# EAGLE design fbrf-rfm22 (EAGLE 4.16)
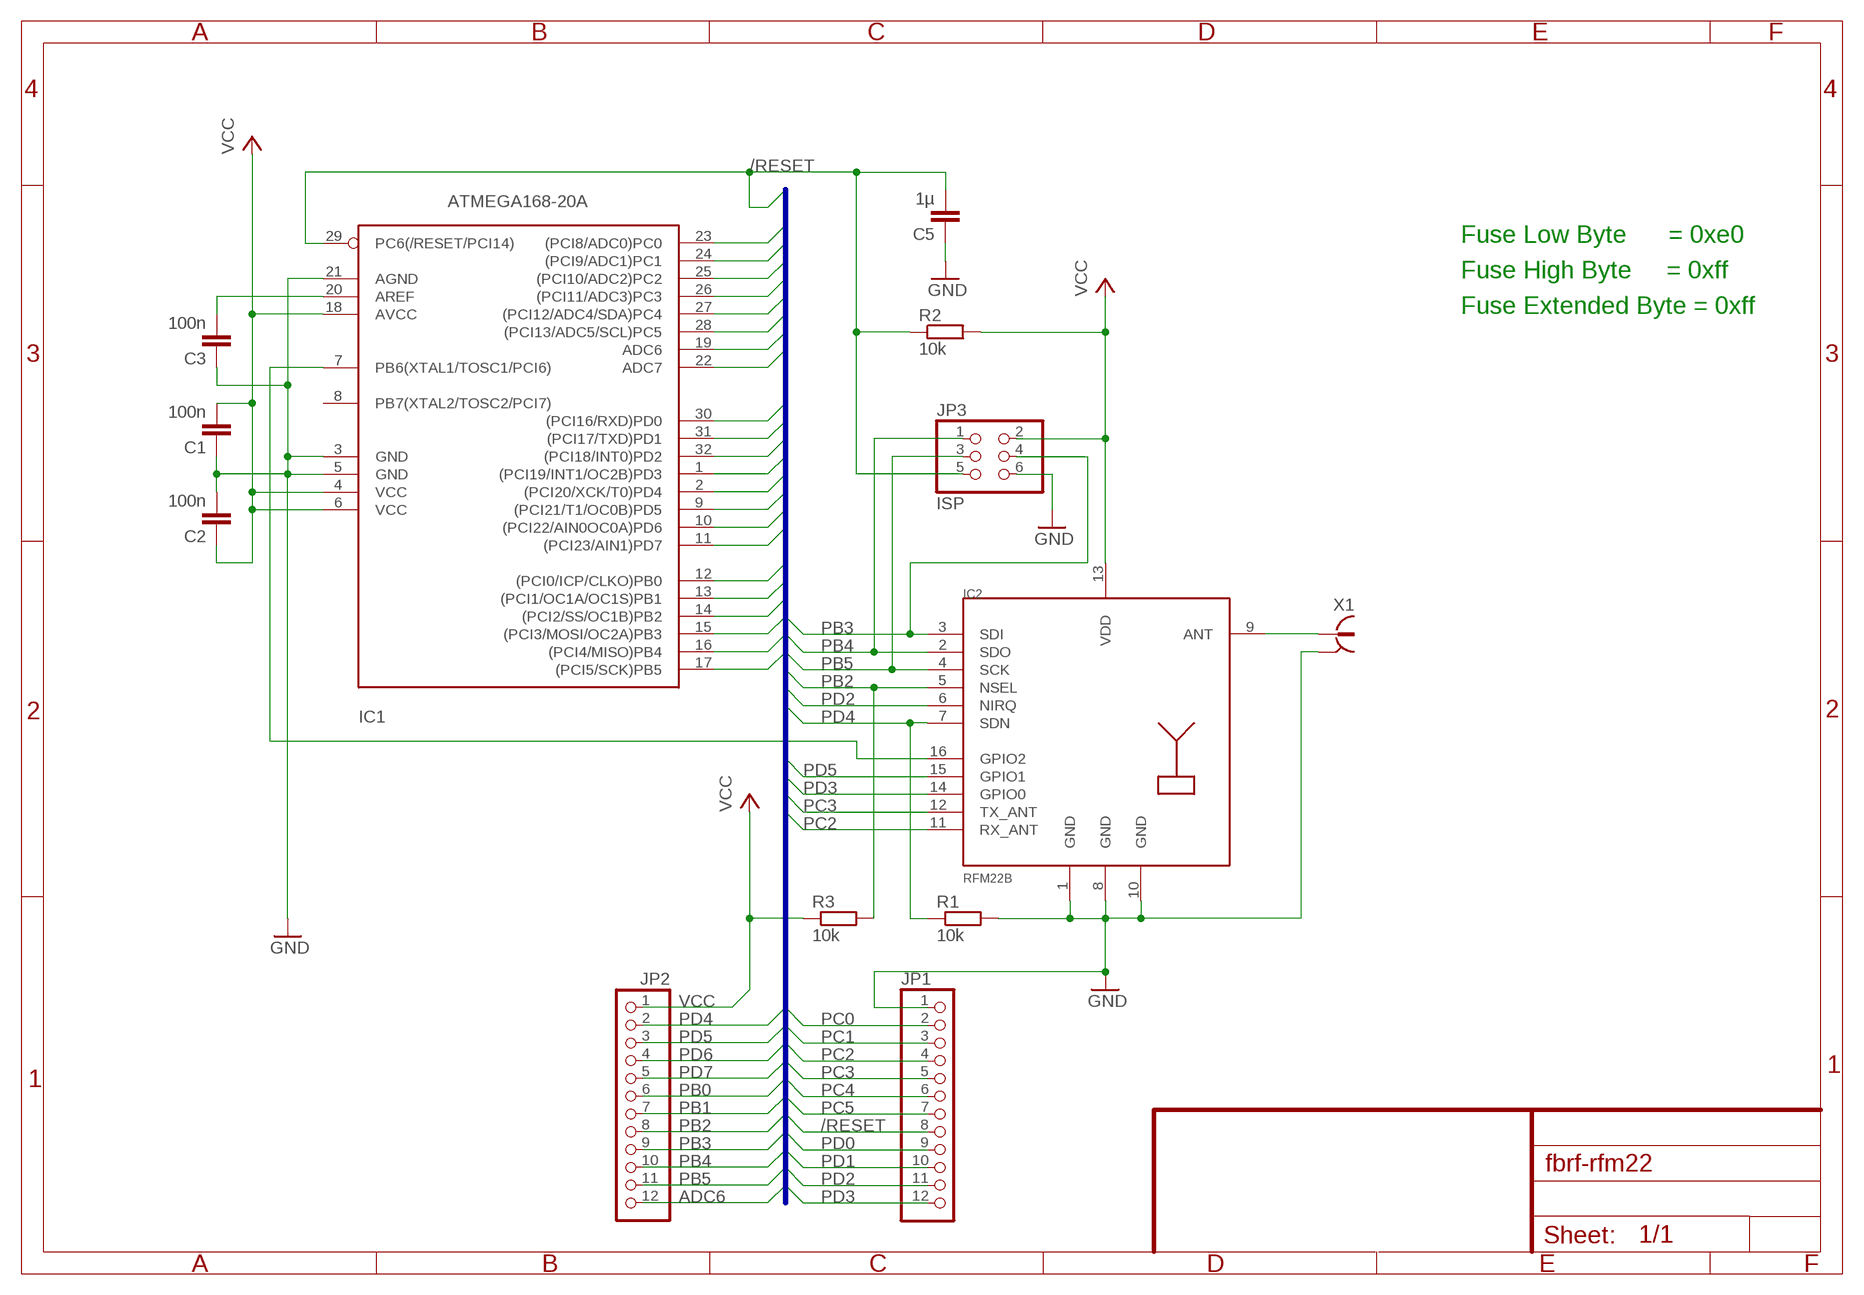
[diagram p0: schematic, sheet 1]

## Parts
C1  100n  C-EUC1206  [C1206]
C2  100n  C-EUC1206  [C1206]
C3  100n  C-EUC1206  [C1206]
C5  1µ  C-EUC0805  [C0805]
IC1  ATMEGA168-20A  ATMEGA88-20A  [TQFP32-08]
IC2  RFM22B  [RFM2]
JP1  PINHD-1X12  [1X12]
JP2  PINHD-1X12  [1X12]
JP3  ISP  PINHD-2X3  [2X03]
R1  10k  R-EU_R0805  [R0805]
R2  10k  R-EU_R0805  [R0805]
R3  10k  R-EU_R0805  [R0805]
X1  ST-SMB-V  [ST-SMB-V]

## Nets
/RESET: C5.2 IC1.29(PC6(/RESET/PCI14)) JP1.8 JP3.5 R2.1
ADC6: IC1.19(ADC6) JP2.12
ADC7: IC1.22(ADC7)
CLK: IC1.7(PB6(XTAL1/TOSC1/PCI6)) IC2.16(GPIO2)
GND: C1.1 C2.2 C3.1 C5.1 IC1.3(GND) IC1.5(GND) IC1.21(AGND) IC2.1(GND) IC2.8(GND) IC2.10(GND) JP1.1 JP3.6 R1.2 X1.2(GND)
N$2: IC2.9(ANT) X1.1
N$3: C3.2 IC1.20(AREF)
PB0: IC1.12((PCI0/ICP/CLKO)PB0) JP2.6
PB1: IC1.13((PCI1/OC1A/OC1S)PB1) JP2.7
PB2: IC1.14((PCI2/SS/OC1B)PB2) IC2.5(NSEL) JP2.8 R3.2
PB3: IC1.15((PCI3/MOSI/OC2A)PB3) IC2.3(SDI) JP2.9 JP3.4
PB4: IC1.16((PCI4/MISO)PB4) IC2.2(SDO) JP2.10 JP3.1
PB5: IC1.17((PCI5/SCK)PB5) IC2.4(SCK) JP2.11 JP3.3
PC0: IC1.23((PCI8/ADC0)PC0) JP1.2
PC1: IC1.24((PCI9/ADC1)PC1) JP1.3
PC2: IC1.25((PCI10/ADC2)PC2) IC2.11(RX_ANT) JP1.4
PC3: IC1.26((PCI11/ADC3)PC3) IC2.12(TX_ANT) JP1.5
PC4: IC1.27((PCI12/ADC4/SDA)PC4) JP1.6
PC5: IC1.28((PCI13/ADC5/SCL)PC5) JP1.7
PD0: IC1.30((PCI16/RXD)PD0) JP1.9
PD1: IC1.31((PCI17/TXD)PD1) JP1.10
PD2: IC1.32((PCI18/INT0)PD2) IC2.6(NIRQ) JP1.11
PD3: IC1.1((PCI19/INT1/OC2B)PD3) IC2.14(GPIO0) JP1.12
PD4: IC1.2((PCI20/XCK/T0)PD4) IC2.7(SDN) JP2.2 R1.1
PD5: IC1.9((PCI21/T1/OC0B)PD5) IC2.15(GPIO1) JP2.3
PD6: IC1.10((PCI22/AIN0OC0A)PD6) JP2.4
PD7: IC1.11((PCI23/AIN1)PD7) JP2.5
VCC: C1.2 C2.1 IC1.4(VCC) IC1.6(VCC) IC1.18(AVCC) IC2.13(VDD) JP2.1 JP3.2 R2.2 R3.1
Unconnected: IC1.8(PB7(XTAL2/TOSC2/PCI7))

## Buses
PC[0..5],ADC6,ADC7,PD[0..7],PB[0..5],/RESET

## Notes on the sheet
- Fuse Low Byte      = 0xe0
- Fuse High Byte     = 0xff
- Fuse Extended Byte = 0xff

## Power pins joined to a net without a drawn wire
GND: X1.3(GND) X1.4(GND) X1.5(GND)

## Library data of the parts
C1-C3 C5 = rcl:C-EU: CAPACITOR, European symbol
IC1 = avr:ATMEGA88: MICROCONTROLLER 8 kBytes FLASH 1 kBytes SRAM 512 Bytes EEPROM USART 8-channel 10 bit ADC
IC2 = RFMxx:RFM22B
JP1 JP2 = pinhead:PINHD-1X12: PIN HEADER
JP3 = pinhead:PINHD-2X3: PIN HEADER
R1-R3 = rcl:R-EU_: RESISTOR, European symbol
X1 = con-coax:ST-SMB-V: MALE SMB CONNECTOR Radiall distributor RS 193-8855G7

## Board
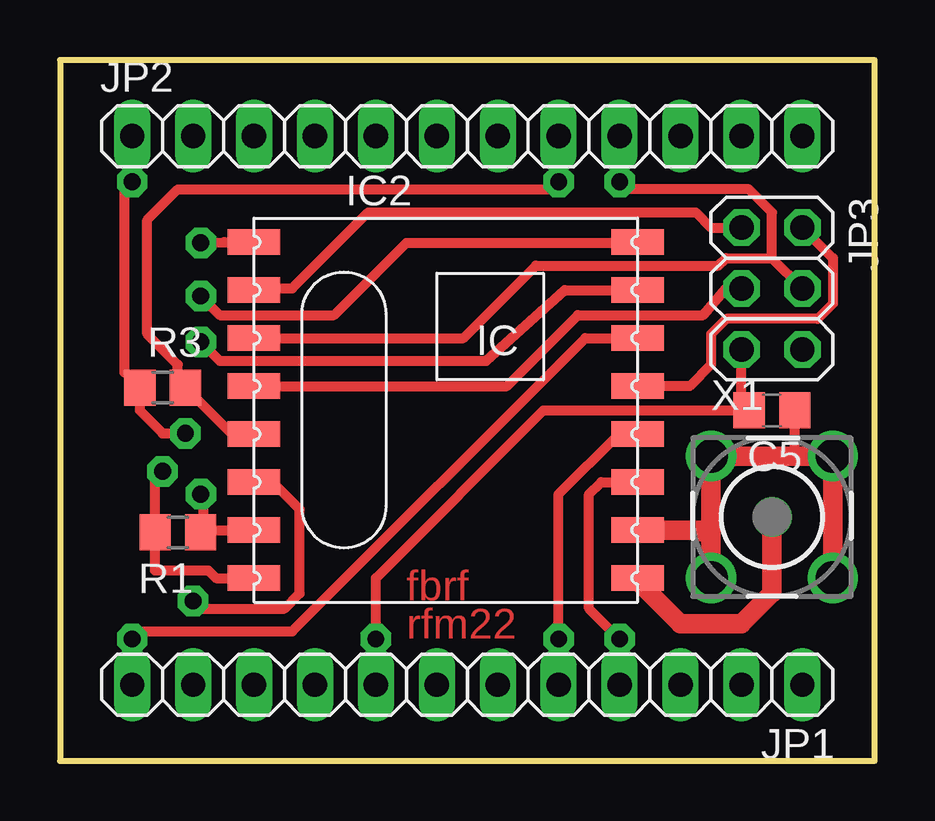
[diagram p1: board, top side]
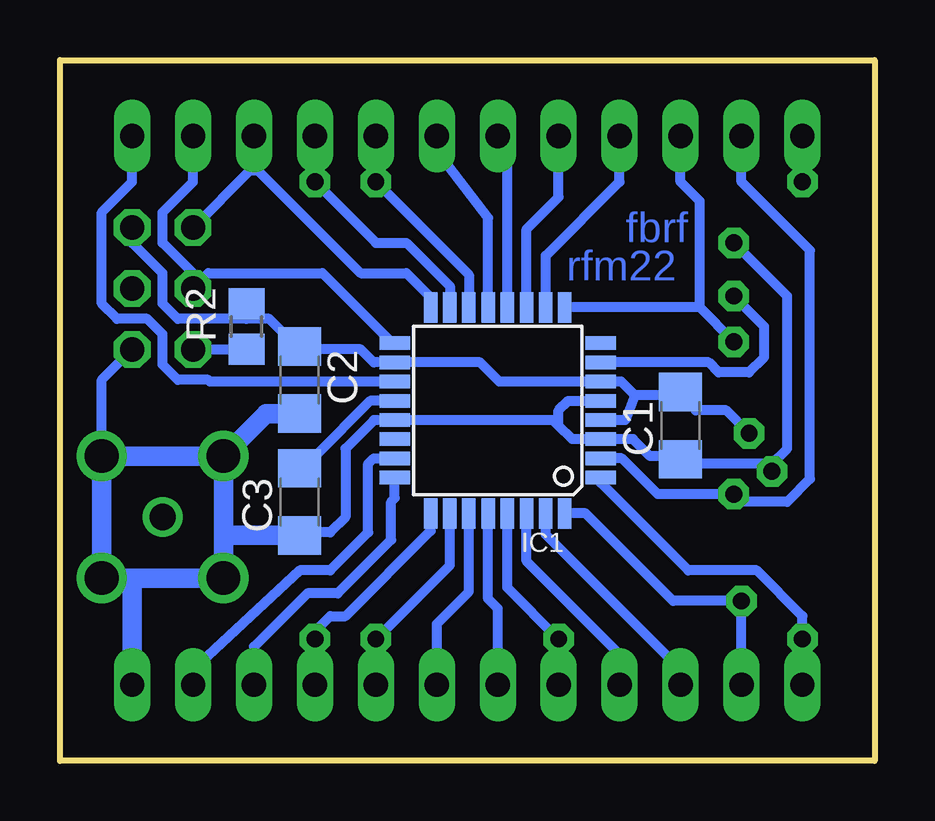
[diagram p2: board, bottom side, seen from below]

Size 33.96 x 29.2 mm. Coordinates in mm from the lower left corner, seen from the top.
Outline: 0,0 33.96,0 33.96,29.2 0,29.2 0,0
Copper layers (1*16): Top 0.035mm / dielectric 1.5mm / Bottom 0.035mm
Design rules "default": minimum track width 10mil, minimum drill 24mil, track to track 8mil, track to pad 8mil, pad to pad 8mil, via to via 8mil, smd to smd 4mil, copper to edge 40mil, drill to drill 8mil, minimum pad ring 10mil, minimum via ring 8mil, stop-mask expansion 4mil, vias tented up to drill 0mil, thermal gap 10mil

### Footprints (pad centres in the part's own frame; a part is rotated, then mirrored left to right if it is on the bottom)
C1206 = smd 1.6 x 1.8: 1 -1.4,0; 2 1.4,0
C0805 = smd 1.3 x 1.5: 1 -0.95,0; 2 0.95,0
TQFP32-08 = smd 1.27 x 0.559: 1 -4.293,2.8; 2 -4.293,2; 3 -4.293,1.2; 4 -4.293,0.4; 5 -4.293,-0.4; 6 -4.293,-1.2; 7 -4.293,-2; 8 -4.293,-2.8; 17 4.293,-2.8; 18 4.293,-2; 19 4.293,-1.2; 20 4.293,-0.4; 21 4.293,0.4; 22 4.293,1.2; 23 4.293,2; 24 4.293,2.8 | smd 0.559 x 1.27: 9 -2.8,-4.293; 10 -2,-4.293; 11 -1.2,-4.293; 12 -0.4,-4.293; 13 0.4,-4.293; 14 1.2,-4.293; 15 2,-4.293; 16 2.8,-4.293; 25 2.8,4.293; 26 2,4.293; 27 1.2,4.293; 28 0.4,4.293; 29 -0.4,4.293; 30 -1.2,4.293; 31 -2,4.293; 32 -2.8,4.293
RFM2 = smd 2.184 x 1.067: 1 -7.62,6.38; 2 -7.62,4.38; 3 -7.62,2.38; 4 -7.62,0.38; 5 -7.62,-1.62; 6 -7.62,-3.62; 7 -7.62,-5.62; 8 -7.62,-7.62; 9 8.38,-7.62; 10 8.38,-5.62; 11 8.38,-3.62; 12 8.38,-1.62; 13 8.38,0.38; 14 8.38,2.38; 15 8.38,4.38; 16 8.38,6.38
1X12 = drill 1.016 long: 1 -13.97,0; 2 -11.43,0; 3 -8.89,0; 4 -6.35,0; 5 -3.81,0; 6 -1.27,0; 7 1.27,0; 8 3.81,0; 9 6.35,0; 10 8.89,0; 11 11.43,0; 12 13.97,0
2X03 = drill 1.016 octagon: 1 -2.54,-1.27; 2 -2.54,1.27; 3 0,-1.27; 4 0,1.27; 5 2.54,-1.27; 6 2.54,1.27
R0805 = smd 1.3 x 1.5: 1 -0.95,0; 2 0.95,0
ST-SMB-V = drill 1.1 round: 1 0,0 | drill 1.4 round: 2 -2.54,2.54; 3 2.54,2.54; 4 2.54,-2.54; 5 -2.54,-2.54

### Placement (x,y rotation side)
C1  8.09,13.97 90 bottom
C2  23.96,15.87 270 bottom
C3  23.96,10.79 90 bottom
C5  29.68,14.6 180 top
IC1  15.71,14.6 180 bottom
IC2  15.71,15.24 0 top
JP1  16.98,3.17 180 top
JP2  16.98,26.03 0 top
JP3  29.68,19.68 270 top
R1  4.92,9.52 180 top
R2  26.19,18.09 90 bottom
R3  4.28,15.55 0 top
X1  29.68,10.16 0 top

### Tracks (layer width: path | path; a pad name or v marks a point on that pad's centre or on a via)
/RESET  (via drill 0.7 pad 1.27)
  Top 0.406: v13.17,5.08 13.17,7.62 20.15,14.6 C5.2 | C5.2 28.41,14.6 | JP3.5 28.41,14.92 C5.2 | C5.2
  Bottom 0.406: IC1.29 15.31,7.21 v13.17,5.08 JP1.8 | R2.1 JP3.5
ADC6
  Bottom 0.406: JP2.12 30.95,24.12 32.22,22.86 32.22,19.04 31.58,18.41 30.31,18.41 29.68,17.77 29.68,16.5 29.04,15.87 27.77,15.87 27.7,15.8 IC1.19
CLK  (via drill 0.7 pad 1.27)
  Top 0.406: IC2.16 23.99,21.61 23.96,21.58 14.44,21.58 11.42,18.57 6.66,18.57 v5.87,19.36
  Bottom 0.406: IC1.7 6.92,16.6 6.5,16.19 5.23,16.19 4.6,16.82 4.6,18.09 v5.87,19.36
GND  (via drill 0.7 pad 1.27)
  Top 0.406: IC2.1 6.85,21.61 v5.87,21.58 | 30,12.7 29.99,12.7 | C5.1 30.63,12.7 | IC2.8 6.5,7.62 6.18,7.93 3.96,7.93 R1.2 3.96,11.75 v4.28,12.06
  Top 0.813: X1.4 X1.3 30.63,12.7 30,12.7 X1.2 27.14,9.52 | X1.5 27.14,9.52 | 27.14,9.52 26.82,9.52 26.73,9.62 IC2.10
  Bottom 0.406: IC1.5 12.77,15 13.17,14.6 13.17,13.97 | 13.17,13.97 12.61,13.4 IC1.3 10.07,13.4 9.36,12.7 8.09,12.7 | 13.17,13.97 13.41,14.2 IC1.21 20.87,14.2 22.06,13.01 22.06,10.16 22.7,9.52 23.96,9.52 C3.1 | 7.96,12.57 C1.1 8.09,12.7 | X1.2 27.27,12.57 | JP3.6 32.22,15.87 X1.3 | v5.87,21.58 3.64,19.36 3.64,13.01 4.28,12.38 v4.28,12.06 4.6,12.38 7.77,12.38 8.09,12.7
  Bottom 0.813: 30.95,7.62 X1.5 27.14,9.52 | 30.95,7.62 X1.4 X1.3 X1.2 | 27.14,9.52 X1.2 | 30.95,7.62 JP1.1 | C3.1 27.01,9.39 27.14,9.52 | C2.2 25.36,14.47 X1.2
N$2
  Top 0.813: X1.1 29.68,6.98 28.41,5.71 25.87,5.71 23.96,7.62 IC2.9
N$3
  Bottom 0.406: IC1.20 21.02,15 23.33,12.7 23.96,12.7 C3.2
PB0
  Bottom 0.406: IC1.12 15.31,24.99 15.71,25.39 JP2.6
PB1
  Bottom 0.406: IC1.13 16.11,22.62 18.25,25.39 JP2.7
PB2  (via drill 0.7 pad 1.27)
  Top 0.406: 8.09,13.65 IC2.5 7.17,13.62 R3.2 | v20.79,24.12 20.47,23.81 4.92,23.81 3.64,22.54 3.64,17.77 4.92,16.5 4.92,15.87 R3.2 | 5.55,15.87 5.55,15.55 R3.2 | R3.2
  Bottom 0.406: IC1.14 16.91,20.24 v20.79,24.12 JP2.8
PB3  (via drill 0.7 pad 1.27)
  Top 0.406: v23.33,24.12 23.65,23.81 28.73,23.81 29.68,22.86 29.68,20.95 | 29.68,20.95 JP3.4 | 29.68,20.95 27.77,20.95 27.46,20.63 19.84,20.63 16.82,17.61 IC2.3
  Bottom 0.406: IC1.15 17.71,19.77 19.52,21.58 20.79,21.58 v23.33,24.12 JP2.9
PB4
  Top 0.406: JP3.1 27.14,22.22 26.5,22.86 12.85,22.86 9.68,19.68 8.09,19.68 IC2.2
  Bottom 0.406: IC1.16 18.51,19.3 19.52,20.31 21.42,20.31 25.71,24.6 | 25.71,24.6 25.87,24.76 JP2.10 | 25.71,24.6 26.03,24.6 JP3.1
PB5
  Top 0.406: JP3.3 27.77,19.68 26.82,18.57 21.58,18.57 18.63,15.62 IC2.4
  Bottom 0.406: JP2.11 28.41,24.12 29.68,22.86 29.68,21.58 28.41,20.31 JP3.3 27.77,20.31 23.01,20.31 20.1,17.4 IC1.17
PC0
  Bottom 0.406: IC1.23 20.88,12.6 21.11,12.38 21.11,9.52 22.7,7.93 23.96,7.93 28.41,3.8 JP1.2
PC1
  Bottom 0.406: IC1.24 20,10.94 20.15,10.79 20.15,9.2 22.38,6.98 23.65,6.98 25.87,4.76 JP1.3
PC2  (via drill 0.7 pad 1.27)
  Top 0.406: IC2.11 22.57,11.62 22.06,11.11 22.06,6.34 v23.33,5.08
  Bottom 0.406: IC1.25 18.51,9.58 22.06,6.03 22.7,6.03 23.33,5.39 v23.33,5.08 JP1.4
PC3  (via drill 0.7 pad 1.27)
  Top 0.406: IC2.12 23.3,13.62 20.79,11.11 v20.79,5.08
  Bottom 0.406: IC1.26 17.71,8.16 v20.79,5.08 JP1.5
PC4
  Bottom 0.406: IC1.27 16.91,7.05 18.25,5.71 JP1.6
PC5
  Bottom 0.406: IC1.28 16.11,6.75 15.71,6.34 JP1.7
PD0
  Bottom 0.406: IC1.30 14.51,8.32 10.63,4.44 JP1.9
PD1
  Bottom 0.406: IC1.31 13.71,9.43 8.09,3.8 JP1.10
PD2  (via drill 0.7 pad 1.27)
  Top 0.406: IC2.6 8.09,11.74 8.73,11.74 10,10.47 10,6.98 9.36,6.34 5.87,6.34 v5.55,6.66
  Bottom 0.406: IC1.32 12.05,10.31 8.41,6.66 v5.55,6.66 JP1.11
PD3  (via drill 0.7 pad 1.27)
  Top 0.406: IC2.14 21.9,17.61 9.68,5.39 3.33,5.39 v3.01,5.08
  Bottom 0.406: 11.01,11.8 IC1.1 11.42,11.58 7.77,7.93 4.92,7.93 3.01,6.03 v3.01,5.08 JP1.12
PD4  (via drill 0.7 pad 1.27)
  Top 0.406: 8.09,9.52 IC2.7 5.96,9.62 | R1.1 5.96,9.62 | 5.96,9.62 5.96,11.01 v5.87,11.11
  Bottom 0.406: IC1.2 10.54,12.6 9.04,11.11 v5.87,11.11 5.55,10.79 3.64,10.79 2.69,11.74 2.69,21.27 5.55,24.12 JP2.2
PD5  (via drill 0.7 pad 1.27)
  Top 0.406: IC2.15 21.04,19.61 17.77,16.66 6.66,16.66 v5.87,17.46
  Bottom 0.406: 7.29,18.89 IC1.9 | v5.87,17.46 7.29,18.89 | JP2.3 8.09,24.12 7.29,23.32 7.29,18.89
PD6
  Bottom 0.406: IC1.10 13.71,21.04 10.63,24.12 JP2.4
PD7
  Bottom 0.406: IC1.11 14.51,22.15 13.17,23.49 JP2.5
VCC  (via drill 0.7 pad 1.27)
  Top 0.406: JP3.2 32.22,20.95 32.22,19.04 31.58,18.41 27.77,18.41 27.14,17.77 27.14,16.5 26.25,15.62 IC2.13 | v5.23,13.65 4.28,13.65 3.33,14.6 R3.1 2.69,16.19 2.69,23.81 v3.01,24.12
  Bottom 0.406: IC1.4 10.4,14.2 10,15.24 | 8.09,15.24 C1.2 8.09,15.55 | 8.09,15.24 10,15.24 | 10,15.24 10.56,15.8 IC1.6 15.64,15.8 16.44,16.6 IC1.18 20.88,16.6 21.42,17.14 23.96,17.14 | v3.01,24.12 JP2.1 | 8.09,15.24 7.46,14.6 6.18,14.6 v5.23,13.65 | JP3.2 30.95,21.58 29.68,20.31 29.68,19.04 29.04,18.41 26.19,18.41 | 23.96,17.14 C2.1 | 23.96,17.14 25.23,18.41 26.19,18.41 | 26.19,18.41 R2.2

### Text on the board
Top: fbrf | rfm22
Bottom: fbrf | rfm22
Document: VCC | PD4 | PD5 | PD6 | PD7 | PB0 | PB1 | PB2 | PB3/MOSI | PB4/MISO | PB5/SCK | ADC6 | PD3 | PD2 | PD1 | PD0 | /RESET | PC5 | PC4 | PC3 | PC2 | PC1 | PC0 | GND